# EAGLE design SEQUIN_TEAR (EAGLE 8.5.1)
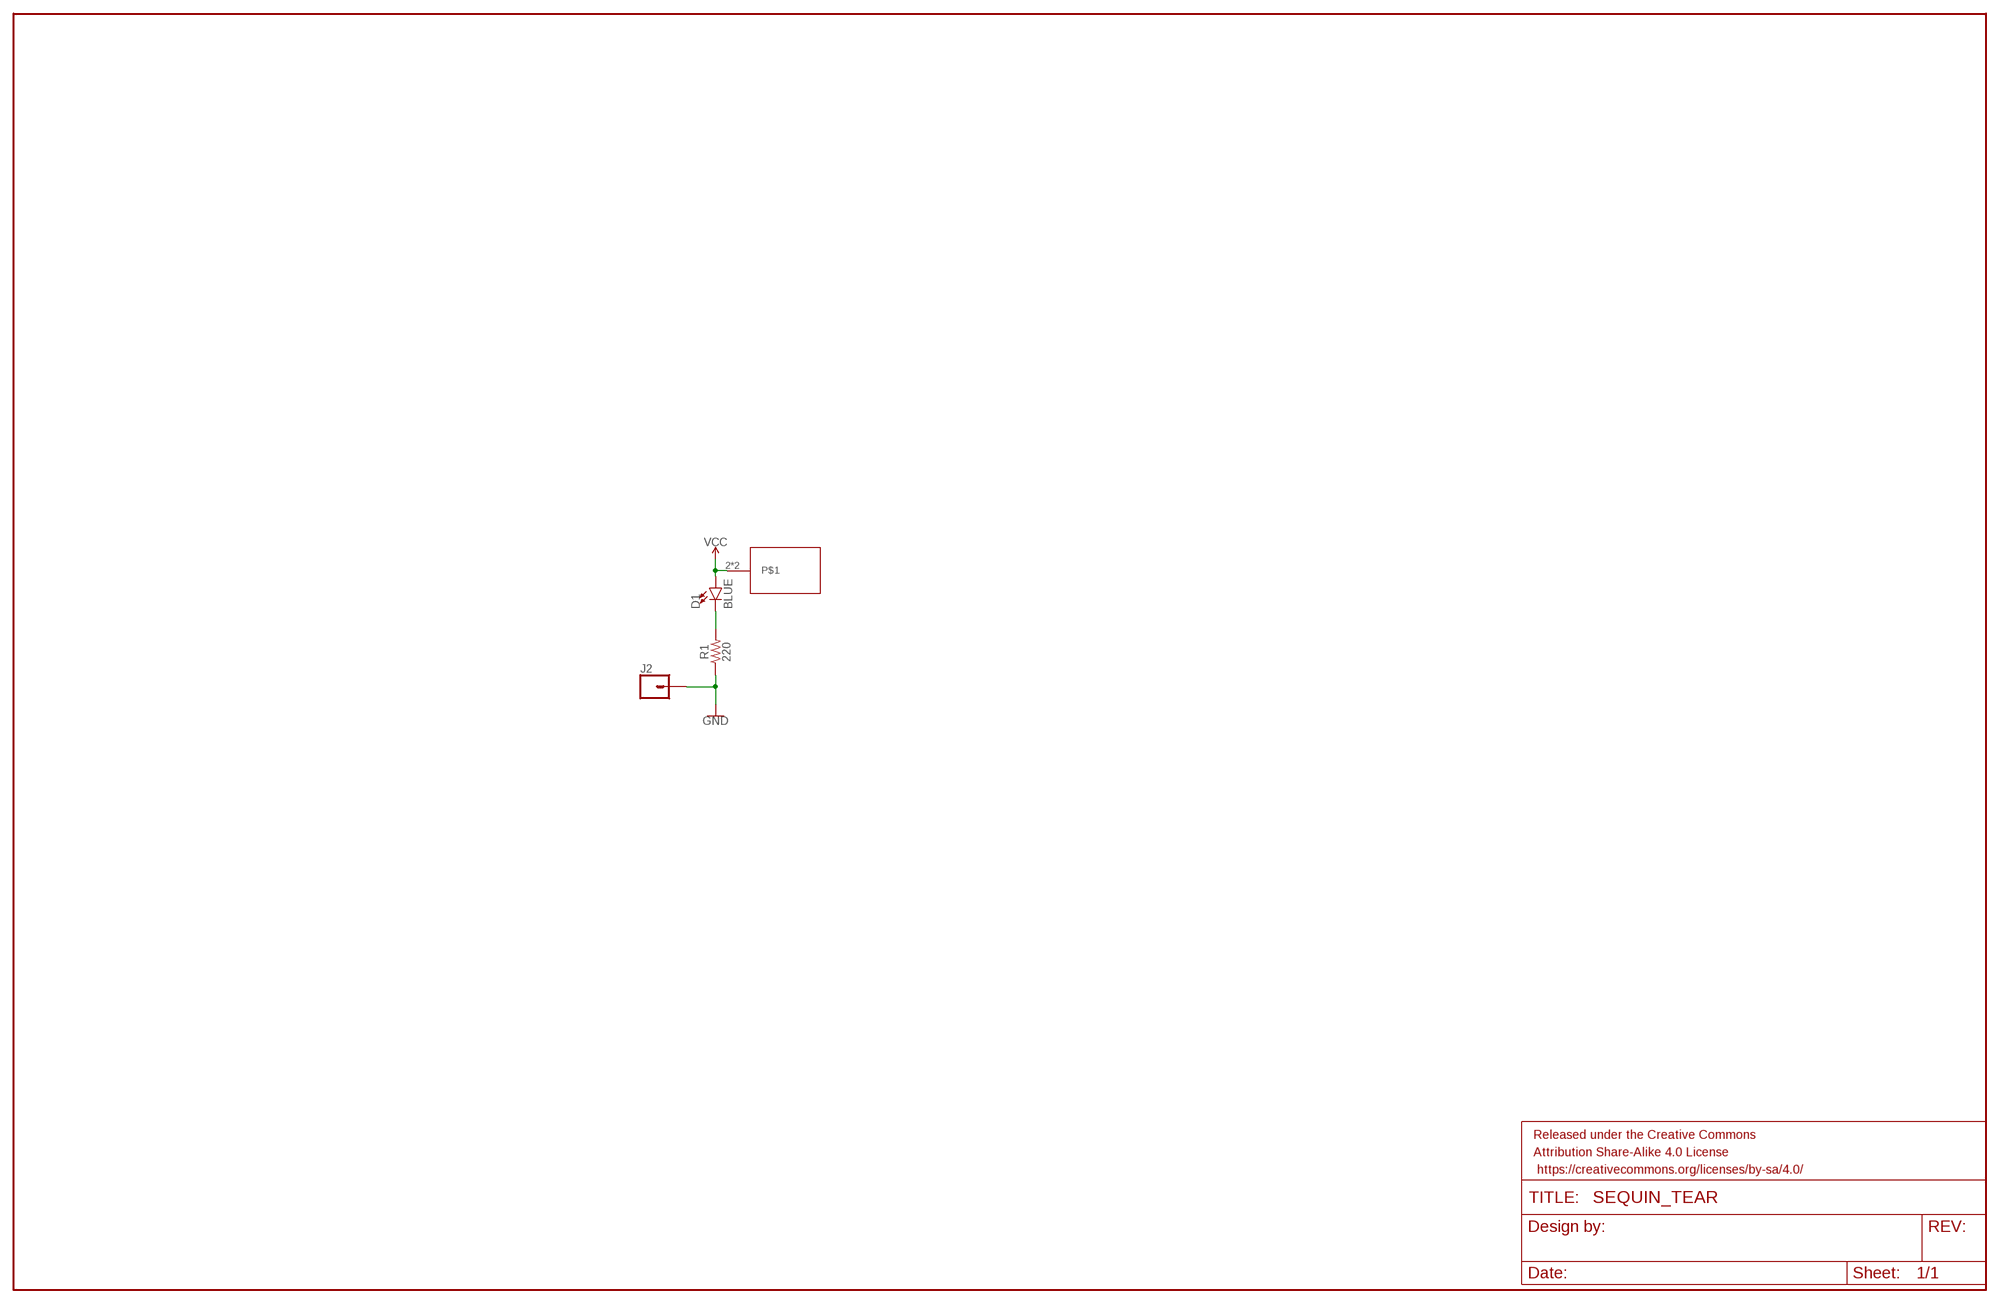
[diagram p0: schematic, sheet 1]

## Parts
D1  BLUE  LED-BLUE1206  [LED-1206]
FRAME1  FRAME-LEDGER  [CREATIVE_COMMONS]
J2  CONN_01SPRING-CONN  [SPRING-CONNECTOR]
R1  220  220OHM-0603-1/10W-1%  [0603]
U$1  TEARDROP  [TEARDROP]

## Nets
GND: J2.P$2 R1.1
N$3: D1.C R1.2
VCC: D1.A U$1.2 U$1.VCC

## Library data of the parts
D1 = SparkFun-LED:LED-BLUE: Blue SMD LED Used in manufacturing of various products at SparkFun Packages: 0603 - SMD 0603 package [Product Link] <http://www.digikey.com/product-detail/en/SMLE12BC7TT86/511-1589-2-ND/1641808> 1206 - SMD1206 package [Product Link] <http://www.digikey.com/product-detail/en/lite-on-inc/LTST-C150TBKT/160-1643-1-ND/573584> SparkFun Products: ESP8266 Thing-Dev Board <https://www.sparkfun.com/products/13711> RedBoard <https://www.sparkfun.com/products/12757>; PROD_ID: DIO-09911
FRAME1 = SparkFun-Aesthetics:FRAME-LEDGER: Schematic Frame - Ledger Standard 11x14 US Ledger frame
J2 = SparkFun-Connectors:CONN_01: Single connection point. Often used as Generic Header-pin footprint for 0.1 inch spaced/style header connections On any of the 0.1 inch spaced packages, you can populate with these: Break Away Headers - Straight <https://www.sparkfun.com/products/116> (PRT-00116) Break Away Male Headers - Right Angle <https://www.sparkfun.com/products/553> (PRT-00553) Female Headers <https://www.sparkfun.com/products/115> (PRT-00115) Break Away Headers - Machine Pin <https://www.sparkfun.com/products/117> (PRT-00117) Break Away Female Headers - Swiss Machine Pin <https://www.sparkfun.com/products/743> (PRT-00743) This device is also useful as a general connection point to wire up your design to another part of your project. Our various solder wires solder well into these plated through hole pads. Hook-Up Wire - Assortment (Stranded, 22 AWG) <https://www.sparkfun.com/products/11375> (PRT-11375) Hook-Up Wire - Assortment (Solid Core, 22 AWG) <https://www.sparkfun.com/products/11367> (PRT-11367) View the entire wire category on our website here <https://www.sparkfun.com/categories/141> Special notes: SMTSO-256-ET is a "flush mount" nut for a 4-40 screw. We mostly use this on specialty testbeds; it is a nice way to connect hardware to your PCB at an adjustable hieght. Also note, the SNAP packages are for using a snappable style connector. We sell a baggie of snaps and they are also used on two LilyPad designs: Snap Assortment - 30 pack (male and female) <https://www.sparkfun.com/products/11347> (DEV-11347) LilyPad Arduino SimpleSnap <https://www.sparkfun.com/products/10941> (DEV-10941) LilyPad SimpleSnap Protoboard <https://www.sparkfun.com/products/10940> (DEV-10940); SF_ID: PRT-11822
R1 = SparkFun-Resistors:220OHM: 220Ω resistor A resistor is a passive two-terminal electrical component that implements electrical resistance as a circuit element. Resistors act to reduce current flow, and, at the same time, act to lower voltage levels within circuits. - Wikipedia; PROD_ID: RES-07861
U$1 = TEARDROP:TEARDROP

## Board
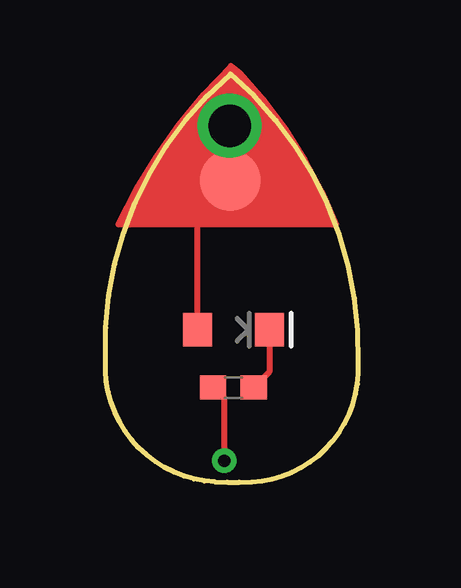
[diagram p1: board, top side]
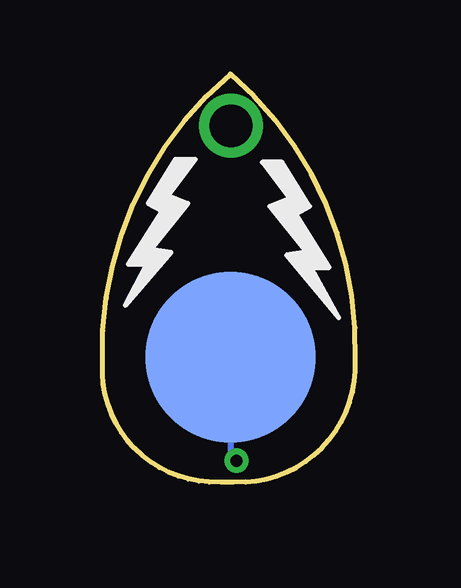
[diagram p2: board, bottom side, seen from below]

Size 10.55 x 17.02 mm. Coordinates in mm from the lower left corner, seen from the top.
Outline: 0,5.08 arc-52 5.21,17.02 arc-52 10.54,4.96 arc-90 6.1,0 arc-2 4.57,0 arc-90 0,5.08
Copper layers (1*16): Top 0.035mm / dielectric 1.5mm / Bottom 0.035mm
Design rules "SparkFun-2-layer-STANDARD": minimum track width 10mil, minimum drill 20mil, track to track 10mil, track to pad 8mil, pad to pad 8mil, via to via 10mil, smd to smd 8mil, copper to edge 8mil, drill to drill 8mil, minimum pad ring 10mil, minimum via ring 10mil, stop-mask expansion 4mil, vias tented up to drill 25mil, thermal gap 10mil

### Footprints (pad centres in the part's own frame; a part is rotated, then mirrored left to right if it is on the bottom)
LED-1206 = smd 1.2 x 1.4: A -1.5,0; C 1.5,0
SPRING-CONNECTOR = smd 7.112 x 7.112: P$2 0,0
0603 = smd 1.1 x 1: 1 -0.85,0; 2 0.85,0
TEARDROP = smd 2.54 x 2.54: 2 0,0 | drill 1.778: VCC -0.025,2.286

### Placement (x,y rotation side)
D1  5.34,6.35 0 top
FRAME1  -76.83,-1.77 0 top  (outside the outline)
J2  5.21,5.21 0 bottom
R1  5.34,3.94 0 top
U$1  5.21,12.58 0 top

### Tracks (layer width: path | path; a pad name or v marks a point on that pad's centre or on a via)
GND  (via drill 0.51)
  Top 0.254: v4.96,0.89 4.96,3.47 R1.1
  Bottom 0.254: J2.P$2 5.21,1.15 v4.96,0.89
N$3
  Top 0.254: D1.C 6.84,4.59 R1.2
VCC
  Top 0.152: U$1.VCC 5.18,12.6 U$1.2
  Top 0.254: D1.A 3.84,11.2 U$1.2